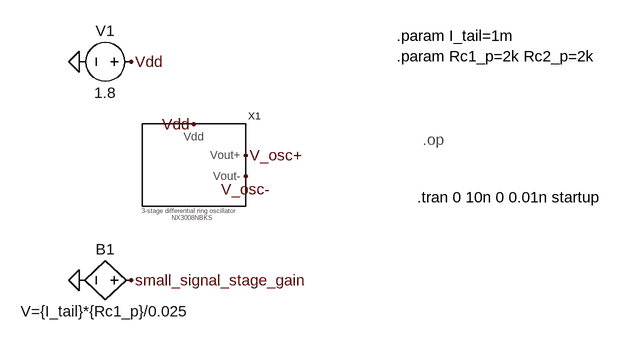
[diagram p0: schematic mosfet_differential_oscillator_sim.asc]
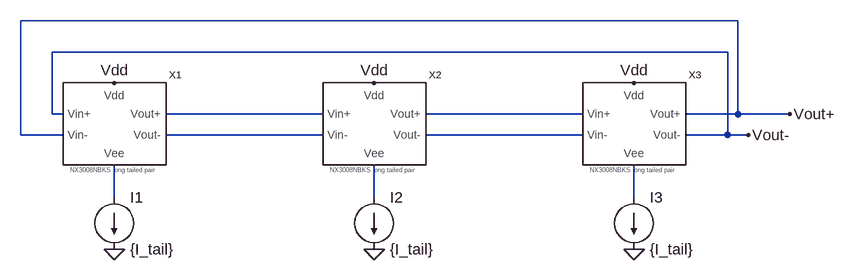
[diagram p1: sub-circuit mosfet_differential_ring_oscillator_3stage.asc]
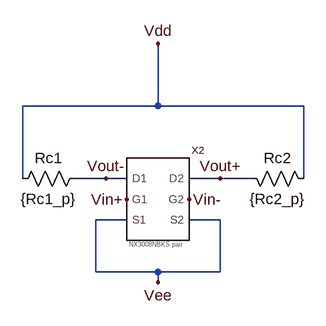
[diagram p2: sub-circuit mosfet_long_tailed_pair.asc]
mosfet_differential_oscillator_sim.asc, the LTspice schematic file:
Version 4.1
SHEET 1 1352 680
FLAG 144 48 Vdd
FLAG 224 96 V_osc+
FLAG -32 -48 0
FLAG 48 -48 Vdd
FLAG -32 288 0
FLAG 48 288 small_signal_stage_gain
FLAG 224 128 V_osc-
SYMBOL voltage 64 -48 R90
WINDOW 0 -32 56 VBottom 2
WINDOW 3 32 56 VTop 2
WINDOW 123 0 0 Left 0
WINDOW 39 0 0 Left 0
SYMATTR InstName V1
SYMATTR Value 1.8
SYMBOL bv 64 288 R90
WINDOW 0 -32 56 VBottom 2
WINDOW 3 32 56 VTop 2
SYMATTR InstName B1
SYMATTR Value V={I_tail}*{Rc1_p}/0.025
SYMBOL mosfet_differential_ring_oscillator_3stage 144 112 R0
SYMATTR InstName X1
TEXT 456 -88 Left 2 !.param I_tail=1m\n.param Rc1_p=2k Rc2_p=2k
TEXT 488 160 Left 2 !.tran 0 10n 0 0.01n startup
TEXT 496 72 Left 2 ;.op

mosfet_differential_ring_oscillator_3stage.asc, the sub-circuit schematic file:
Version 4.1
SHEET 1 1528 680
WIRE 1184 -48 80 -48
WIRE 1168 0 128 0
WIRE 128 96 128 0
WIRE 144 96 128 96
WIRE 544 96 304 96
WIRE 944 96 704 96
WIRE 1184 96 1184 -48
WIRE 1184 96 1104 96
WIRE 1264 96 1184 96
WIRE 80 128 80 -48
WIRE 144 128 80 128
WIRE 544 128 304 128
WIRE 944 128 704 128
WIRE 1168 128 1168 0
WIRE 1168 128 1104 128
WIRE 1200 128 1168 128
WIRE 224 224 224 176
WIRE 624 224 624 176
WIRE 1024 224 1024 176
FLAG 224 48 Vdd
FLAG 624 48 Vdd
FLAG 1024 48 Vdd
FLAG 624 304 0
FLAG 1024 304 0
FLAG 224 304 0
FLAG 1264 96 Vout+
FLAG 1200 128 Vout-
SYMBOL current 224 224 R0
SYMATTR InstName I1
SYMATTR Value {I_tail}
SYMBOL current 624 224 R0
SYMATTR InstName I2
SYMATTR Value {I_tail}
SYMBOL current 1024 224 R0
SYMATTR InstName I3
SYMATTR Value {I_tail}
SYMBOL mosfet_long_tailed_pair 224 112 R0
SYMATTR InstName X1
SYMBOL mosfet_long_tailed_pair 624 112 R0
SYMATTR InstName X2
SYMBOL mosfet_long_tailed_pair 1024 112 R0
SYMATTR InstName X3

mosfet_long_tailed_pair.asc, the sub-circuit schematic file:
Version 4.1
SHEET 1 1140 680
WIRE 208 32 208 -64
WIRE 208 32 0 32
WIRE 432 32 208 32
WIRE 0 144 0 32
WIRE 128 144 80 144
WIRE 160 144 128 144
WIRE 304 144 256 144
WIRE 352 144 304 144
WIRE 432 144 432 32
WIRE 160 208 112 208
WIRE 304 208 256 208
WIRE 112 288 112 208
WIRE 208 288 112 288
WIRE 304 288 304 208
WIRE 304 288 208 288
WIRE 208 304 208 288
FLAG 208 -64 Vdd
FLAG 160 176 Vin+
FLAG 256 176 Vin-
FLAG 208 304 Vee
FLAG 128 144 Vout-
FLAG 304 144 Vout+
SYMBOL res 96 128 R90
WINDOW 0 0 56 VBottom 2
WINDOW 3 32 56 VTop 2
SYMATTR InstName Rc1
SYMATTR Value {Rc1_p}
SYMBOL res 336 128 M90
WINDOW 0 0 56 VBottom 2
WINDOW 3 32 56 VTop 2
SYMATTR InstName Rc2
SYMATTR Value {Rc2_p}
SYMBOL NX3008NBKS_pair 224 176 R0
SYMATTR InstName X2

The netlist it stands for:
* mosfet_differential_oscillator_sim.asc
V1 Vdd 0 1.8
B1 small_signal_stage_gain 0 V={I_tail}*{Rc1_p}/0.025
X§X1 Vdd V_osc+ V_osc- mosfet_differential_ring_oscillator_3stage

* block symbol definitions
.subckt mosfet_differential_ring_oscillator_3stage Vdd Vout+ Vout-
I1 N005 0 {I_tail}
I2 N006 0 {I_tail}
I3 N007 0 {I_tail}
X§X1 Vdd Vout- Vout+ N005 N001 N003 mosfet_long_tailed_pair
X§X2 Vdd N001 N003 N006 N002 N004 mosfet_long_tailed_pair
X§X3 Vdd N002 N004 N007 Vout+ Vout- mosfet_long_tailed_pair
.ends mosfet_differential_ring_oscillator_3stage

.subckt mosfet_long_tailed_pair Vdd Vin+ Vin- Vee Vout+ Vout-
Rc1 Vout- Vdd {Rc1_p}
Rc2 Vout+ Vdd {Rc2_p}
X§X2 Vout- Vin+ Vee Vout+ Vin- Vee NX3008NBKS_pair  ; pins D1 G1 S1 D2 G2 S2
.ends mosfet_long_tailed_pair

.param I_tail=1m
.param Rc1_p=2k Rc2_p=2k
.tran 0 10n 0 0.01n startup
* .op
.backanno
.end